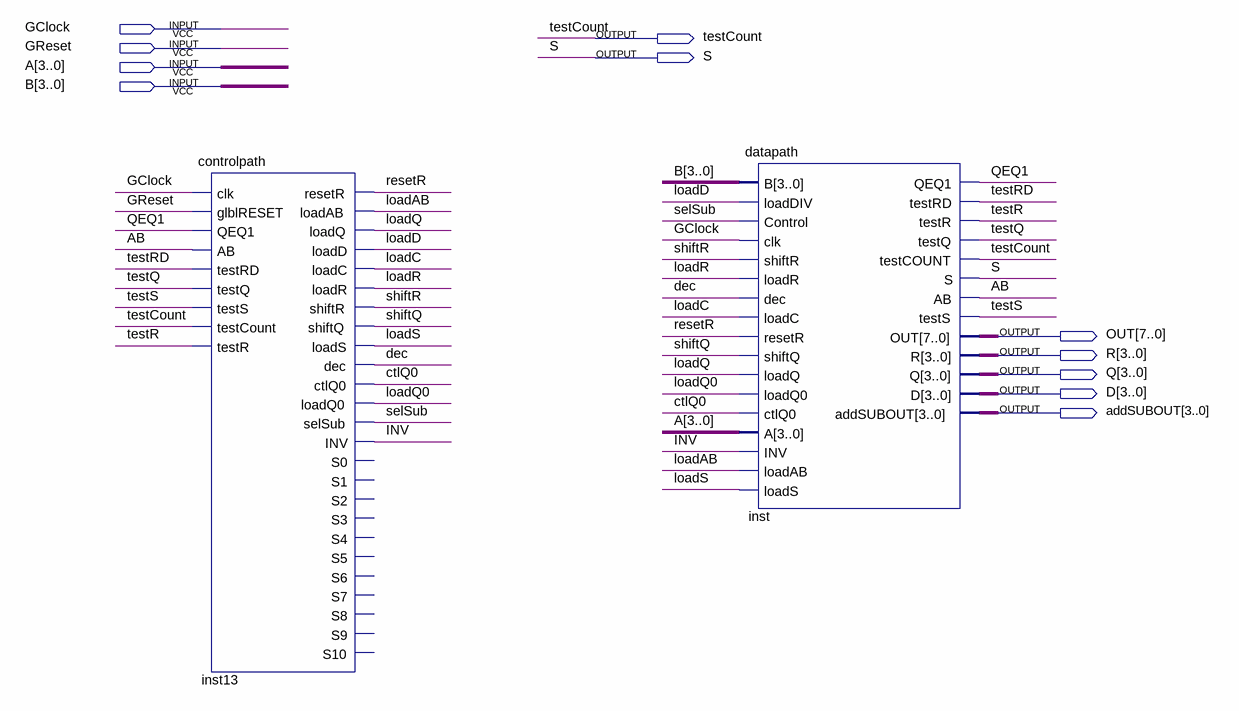
[diagram p0: schematic sheet]
// Quartus schematic fullDivider.bdf as structural Verilog: 2 symbols, 11 pins
module fullDivider (
  input  GClock,
  input  GReset,
  input  [3:0] A,
  input  [3:0] B,
  output testCount,
  output S,
  output [7:0] OUT,
  output [3:0] R,
  output [3:0] Q,
  output [3:0] D,
  output [3:0] addSUBOUT
);

  wire AB, ctlQ0, dec, INV, loadAB, loadC, loadD, loadQ, loadQ0, loadR, loadS, QEQ1, resetR, selSub, shiftQ,
       shiftR, testQ, testR, testRD, testS;

  controlpath inst13 (
    .clk(GClock), .glblRESET(GReset), .QEQ1(QEQ1), .AB(AB), .testRD(testRD), .testQ(testQ), .testS(testS),
    .testCount(testCount), .testR(testR), .resetR(resetR), .loadAB(loadAB), .loadQ(loadQ), .loadD(loadD),
    .loadC(loadC), .loadR(loadR), .shiftR(shiftR), .shiftQ(shiftQ), .loadS(loadS), .dec(dec), .ctlQ0(ctlQ0),
    .loadQ0(loadQ0), .selSub(selSub), .INV(INV));  // open: S0, S1, S2, S3, S4, S5, S6, S7, S8, S9, S10
  datapath inst (
    .B(B), .loadDIV(loadD), .Control(selSub), .clk(GClock), .shiftR(shiftR), .loadR(loadR), .dec(dec),
    .loadC(loadC), .resetR(resetR), .shiftQ(shiftQ), .loadQ(loadQ), .loadQ0(loadQ0), .ctlQ0(ctlQ0), .A(A),
    .INV(INV), .loadAB(loadAB), .loadS(loadS), .QEQ1(QEQ1), .testRD(testRD), .testR(testR), .testQ(testQ),
    .testCOUNT(testCount), .S(S), .AB(AB), .testS(testS), .OUT(OUT), .R(R), .Q(Q), .D(D),
    .addSUBOUT(addSUBOUT));
endmodule
